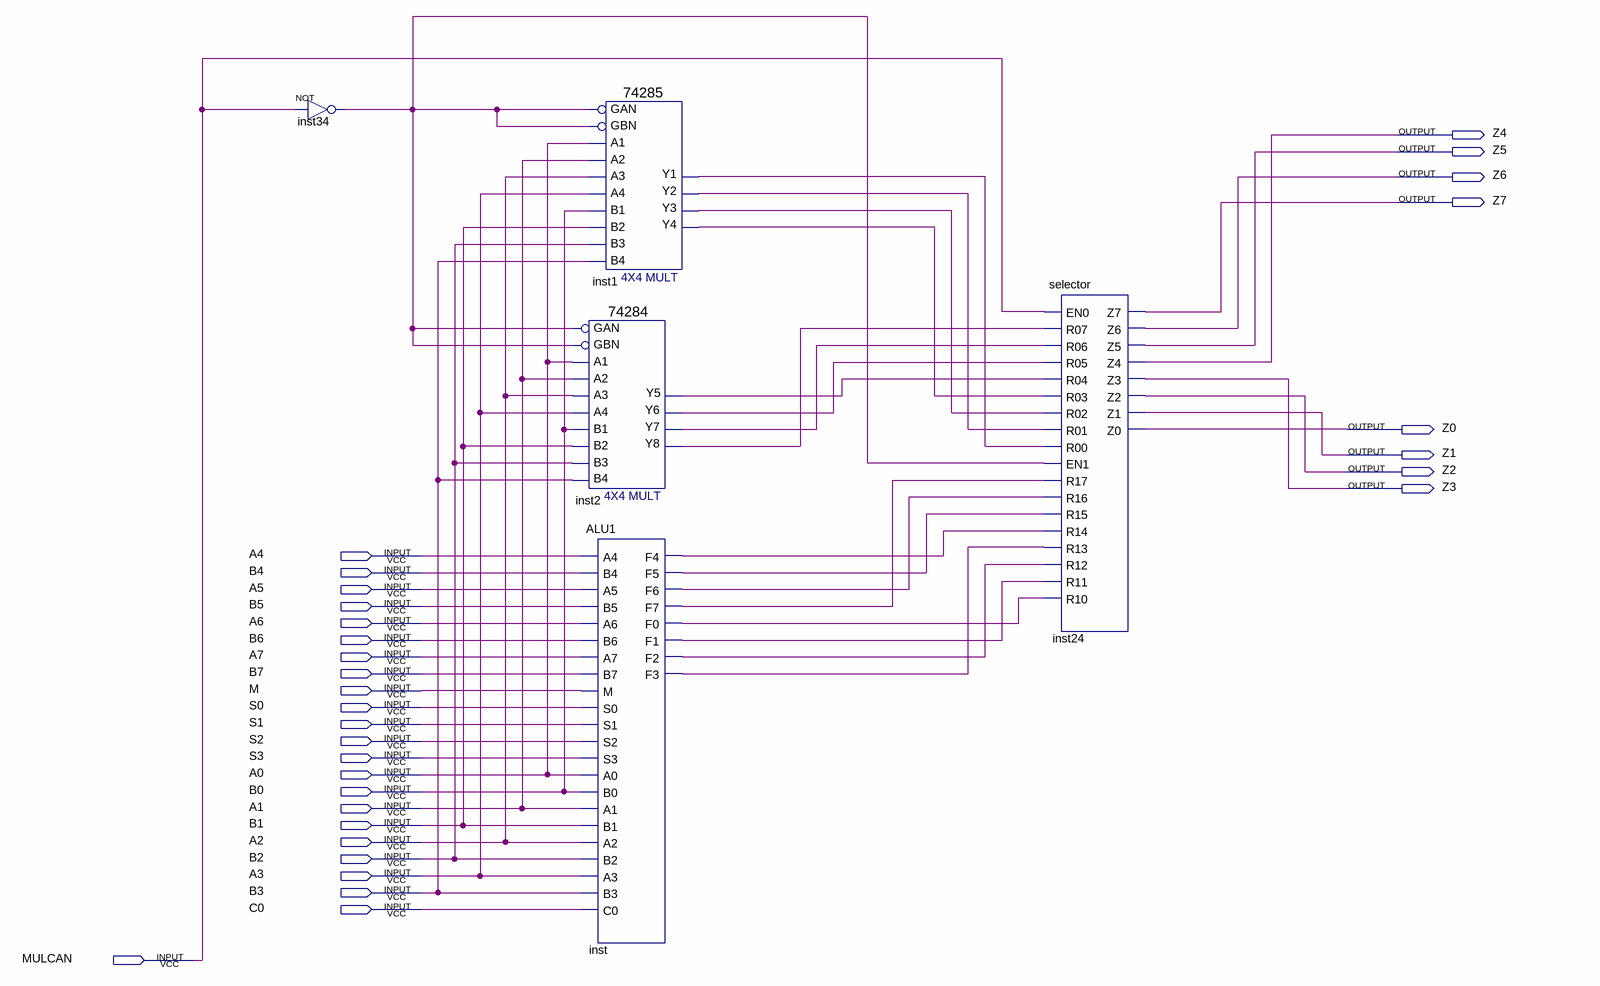
[diagram p0: schematic sheet]
// Quartus schematic ALU2.bdf as structural Verilog: 5 symbols, 31 pins
module ALU2 (
  input  A4,
  input  B4,
  input  A5,
  input  B5,
  input  A6,
  input  B6,
  input  A7,
  input  B7,
  input  M,
  input  S0,
  input  S1,
  input  S2,
  input  S3,
  input  A0,
  input  B0,
  input  A1,
  input  B1,
  input  A2,
  input  B2,
  input  A3,
  input  B3,
  input  C0,
  input  MULCAN,
  output Z4,
  output Z5,
  output Z6,
  output Z7,
  output Z0,
  output Z1,
  output Z2,
  output Z3
);

  wire inst1_y1, inst1_y2, inst1_y3, inst1_y4, inst2_y5, inst2_y6, inst2_y7, inst2_y8, inst34_out, inst_f0,
       inst_f1, inst_f2, inst_f3, inst_f4, inst_f5, inst_f6, inst_f7;

  not inst34 (inst34_out, MULCAN);
  \74285  inst1 (
    .GBN(inst34_out), .GAN(inst34_out), .A1(A0), .A2(A1), .A3(A2), .B2(B1), .B1(B0), .A4(A3), .B4(B3),
    .B3(B2), .Y4(inst1_y4), .Y1(inst1_y1), .Y2(inst1_y2), .Y3(inst1_y3));
  \74284  inst2 (
    .GAN(inst34_out), .A2(A1), .A1(A0), .GBN(inst34_out), .B1(B0), .A4(A3), .A3(A2), .B4(B3), .B3(B2),
    .B2(B1), .Y8(inst2_y8), .Y6(inst2_y6), .Y7(inst2_y7), .Y5(inst2_y5));
  ALU1 inst (
    .A4(A4), .B4(B4), .A5(A5), .B5(B5), .A6(A6), .B6(B6), .A7(A7), .B7(B7), .M(M), .S0(S0), .S1(S1), .S2(S2),
    .S3(S3), .A0(A0), .B0(B0), .A1(A1), .B1(B1), .A2(A2), .B2(B2), .A3(A3), .B3(B3), .C0(C0), .F4(inst_f4),
    .F5(inst_f5), .F6(inst_f6), .F7(inst_f7), .F0(inst_f0), .F1(inst_f1), .F2(inst_f2), .F3(inst_f3));
  selector inst24 (
    .EN0(MULCAN), .R07(inst2_y8), .R06(inst2_y7), .R05(inst2_y6), .R04(inst2_y5), .R03(inst1_y4),
    .R02(inst1_y3), .R01(inst1_y2), .R00(inst1_y1), .EN1(inst34_out), .R17(inst_f7), .R16(inst_f6),
    .R15(inst_f5), .R14(inst_f4), .R13(inst_f3), .R12(inst_f2), .R11(inst_f1), .R10(inst_f0), .Z7(Z7),
    .Z6(Z6), .Z5(Z5), .Z4(Z4), .Z3(Z3), .Z2(Z2), .Z1(Z1), .Z0(Z0));
endmodule
